# EAGLE schematic TTGO_shield_revE (EAGLE 9.0.1)
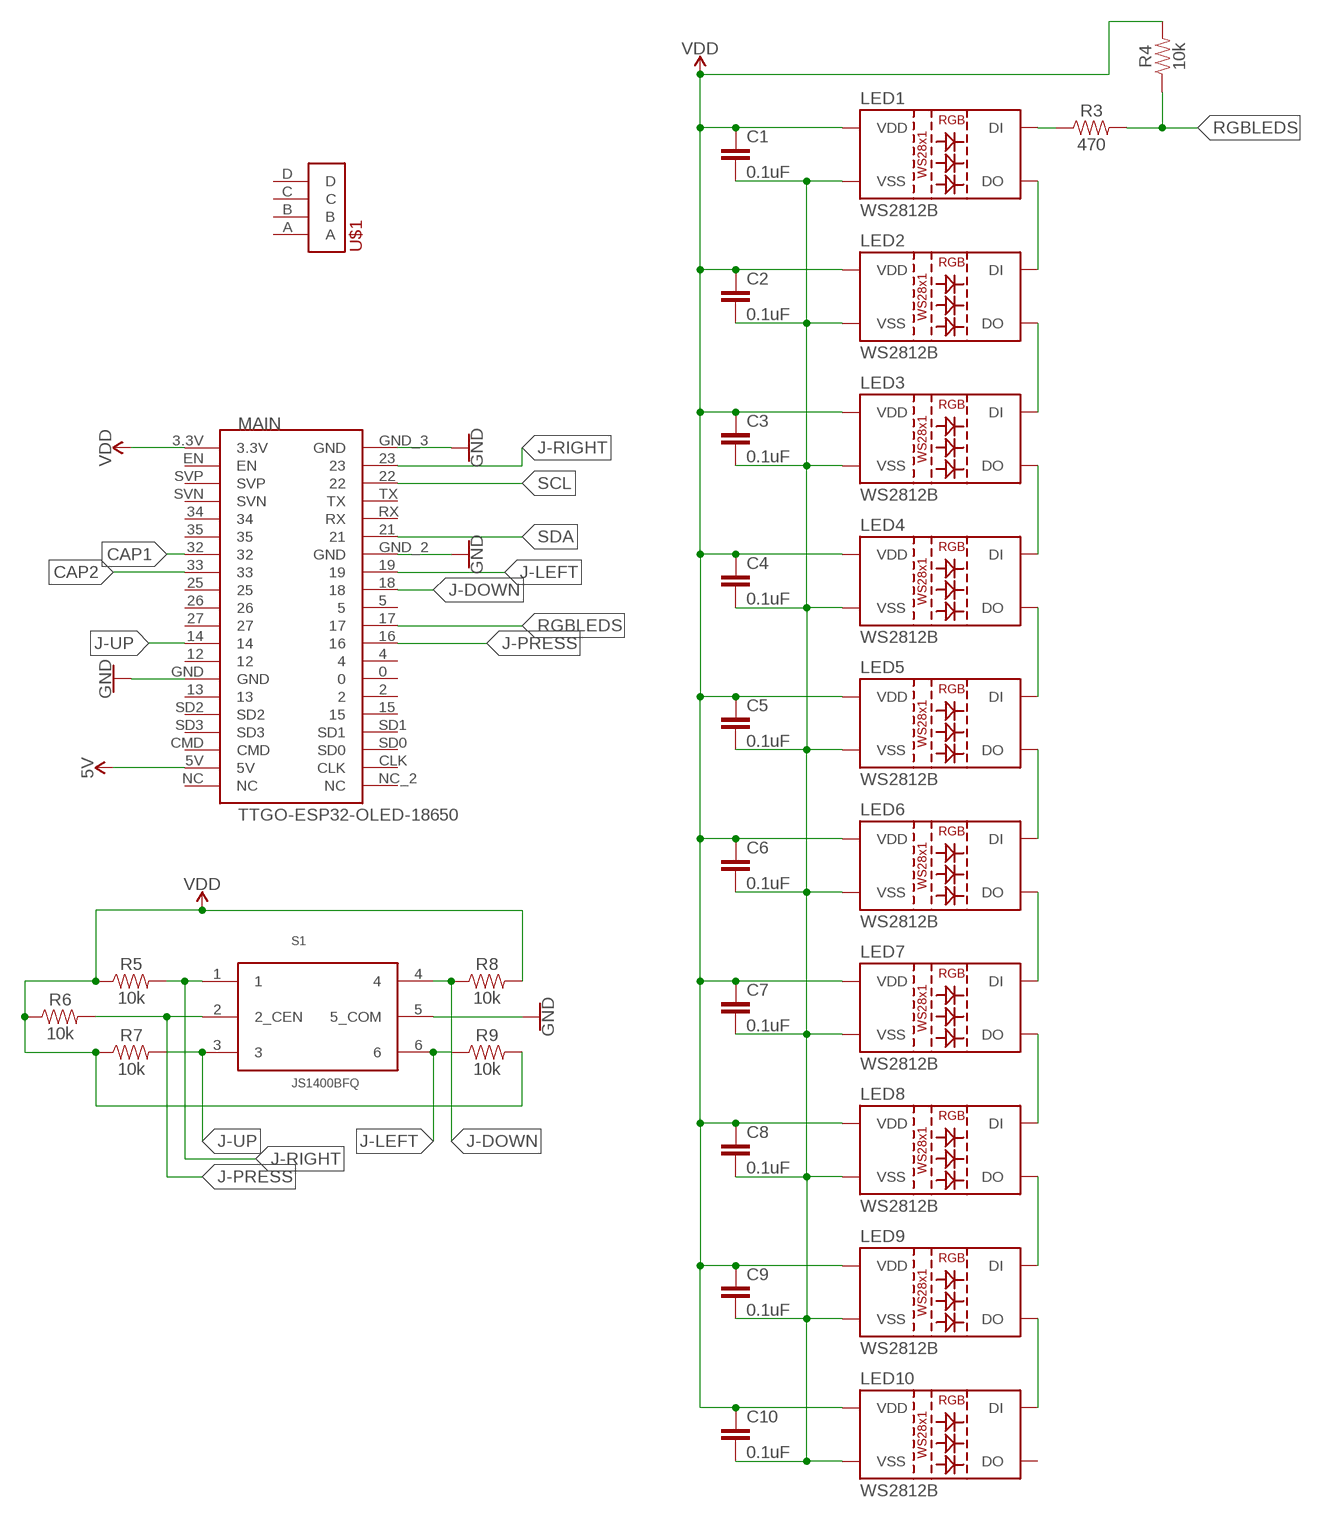
[diagram p0: schematic, sheet 1]

## Parts
C1  0.1uF  0.1UF-0603-25V-5%  [0603]
C2  0.1uF  0.1UF-0603-25V-5%  [0603]
C3  0.1uF  0.1UF-0603-25V-5%  [0603]
C4  0.1uF  0.1UF-0603-25V-5%  [0603]
C5  0.1uF  0.1UF-0603-25V-5%  [0603]
C6  0.1uF  0.1UF-0603-25V-5%  [0603]
C7  0.1uF  0.1UF-0603-25V-5%  [0603]
C8  0.1uF  0.1UF-0603-25V-5%  [0603]
C9  0.1uF  0.1UF-0603-25V-5%  [0603]
C10  0.1uF  0.1UF-0603-25V-5%  [0603]
LED1  WS2812B  [WS2812B]
LED2  WS2812B  [WS2812B]
LED3  WS2812B  [WS2812B]
LED4  WS2812B  [WS2812B]
LED5  WS2812B  [WS2812B]
LED6  WS2812B  [WS2812B]
LED7  WS2812B  [WS2812B]
LED8  WS2812B  [WS2812B]
LED9  WS2812B  [WS2812B]
LED10  WS2812B  [WS2812B]
MAIN  TTGO-ESP32-OLED-18650  [TTGO-ESP32-OLED-18650]
R3  470  470OHM-0603-1/10W-1%  [0603]
R4  10k  10KOHM-0603-1/10W-1%  [0603]
R5  10k  10KOHM-0603-1/10W-1%  [0603]
R6  10k  10KOHM-0603-1/10W-1%  [0603]
R7  10k  10KOHM-0603-1/10W-1%  [0603]
R8  10k  10KOHM-0603-1/10W-1%  [0603]
R9  10k  10KOHM-0603-1/10W-1%  [0603]
S1  JS1400BFQ  [JS1400BFQ]
U$1  10120045-400LF  [10120045-400LF]

## Nets
5V: MAIN.5V
CAP1: MAIN.32
CAP2: MAIN.33
GND: MAIN.GND MAIN.GND_2(GND) MAIN.GND_3(GND) S1.5(5_COM)
GND1: C1.2 C2.2 C3.2 C4.2 C5.2 C6.2 C7.2 C8.2 C9.2 C10.2 LED1.3(VSS) LED2.3(VSS) LED3.3(VSS) LED4.3(VSS) LED5.3(VSS) LED6.3(VSS) LED7.3(VSS) LED8.3(VSS) LED9.3(VSS) LED10.3(VSS)
J-DOWN: MAIN.18 R8.1 S1.4
J-LEFT: MAIN.19 R9.1 S1.6
J-PRESS: MAIN.16 R6.2 S1.2(2_CEN)
J-RIGHT: MAIN.23 R5.2 S1.1
J-UP: MAIN.14 R7.2 S1.3
N$1: LED5.2(DO) LED6.4(DI)
N$2: LED6.2(DO) LED7.4(DI)
N$3: LED7.2(DO) LED8.4(DI)
N$4: LED8.2(DO) LED9.4(DI)
N$5: LED4.2(DO) LED5.4(DI)
N$6: LED9.2(DO) LED10.4(DI)
N$9: LED1.2(DO) LED2.4(DI)
N$10: LED2.2(DO) LED3.4(DI)
N$11: LED3.2(DO) LED4.4(DI)
N$12: LED1.4(DI) R3.1
RGBLEDS: MAIN.17 R3.2 R4.1
SCL: MAIN.22
SDA: MAIN.21
VDD: C1.1 C2.1 C3.1 C4.1 C5.1 C6.1 C7.1 C8.1 C9.1 C10.1 LED1.1(VDD) LED2.1(VDD) LED3.1(VDD) LED4.1(VDD) LED5.1(VDD) LED6.1(VDD) LED7.1(VDD) LED8.1(VDD) LED9.1(VDD) LED10.1(VDD) MAIN.3.3V R4.2 R5.1 R6.1 R7.1 R8.2 R9.2
Unconnected: LED10.2(DO) MAIN.0 MAIN.2 MAIN.4 MAIN.5 MAIN.12 MAIN.13 MAIN.15 MAIN.25 MAIN.26 MAIN.27 MAIN.34 MAIN.35 MAIN.CLK MAIN.CMD MAIN.EN MAIN.NC MAIN.NC_2(NC) MAIN.RX MAIN.SD0 MAIN.SD1 MAIN.SD2 MAIN.SD3 MAIN.SVN MAIN.SVP MAIN.TX U$1.A U$1.B U$1.C U$1.D

## Library data of the parts
C1-C10 = SparkFun-Capacitors:0.1UF: 0.1µF ceramic capacitors A capacitor is a passive two-terminal electrical component used to store electrical energy temporarily in an electric field.; PROD_ID: CAP-08604
LED1-LED10 = SparkFun-LED:WS2812B: WS2812B SMD addressable RGB LED 5x5mm SMD LED with built-in controller IC. Color: Red/Green/Blue mC Rating: RGB: 390, 660, 180 mcd Forward Voltage: RGB: 2.0, 3.0, 3.0 V Packages:WS2812B SparkFun Products: Blynk Board - ESP8266 <https://www.sparkfun.com/products/13794>; PROD_ID: DIO-12503
MAIN = BadgeParts:TTGO-ESP32-OLED-18650: Input-only pins: IO34, IO35, Sensor_VP, Sensor_VN, are labeled in docs as GPI (note the lack of O), which may mean they're input-only pins. Pins 4 and 5 go to the OLED SDA/SCL IO32 IO33 are connected to the crystal. Docs say you can't use these 2x pins as GPIO unless you desolder some stuff on the module. There's 5 "strapping" pins, which effect how the ESP-32 boots depending on if they're pulled high or low. So it's possible that something you've hooked upto these pins may effect how it boots. These pins are: 0 2 5 12 15
R3 = SparkFun-Resistors:470OHM: 470Ω resistor A resistor is a passive two-terminal electrical component that implements electrical resistance as a circuit element. Resistors act to reduce current flow, and, at the same time, act to lower voltage levels within circuits. - Wikipedia; PROD_ID: RES-07869
R4-R9 = SparkFun-Resistors:10KOHM: 10kΩ resistor A resistor is a passive two-terminal electrical component that implements electrical resistance as a circuit element. Resistors act to reduce current flow, and, at the same time, act to lower voltage levels within circuits. - Wikipedia; PROD_ID: RES-00824
S1 = BadgeParts:JS1400BFQ: 5-way SMD tactile switch
U$1 = BadgeParts:10120045-400LF: SSL Connector 4 Position Blade and Receptacle, Hermaphroditic Board to Board 0.118" (3.00mm) Solder Datasheet <https://cdn.amphenol-icc.com/media/wysiwyg/files/drawing/10120045-400lf.pdf>